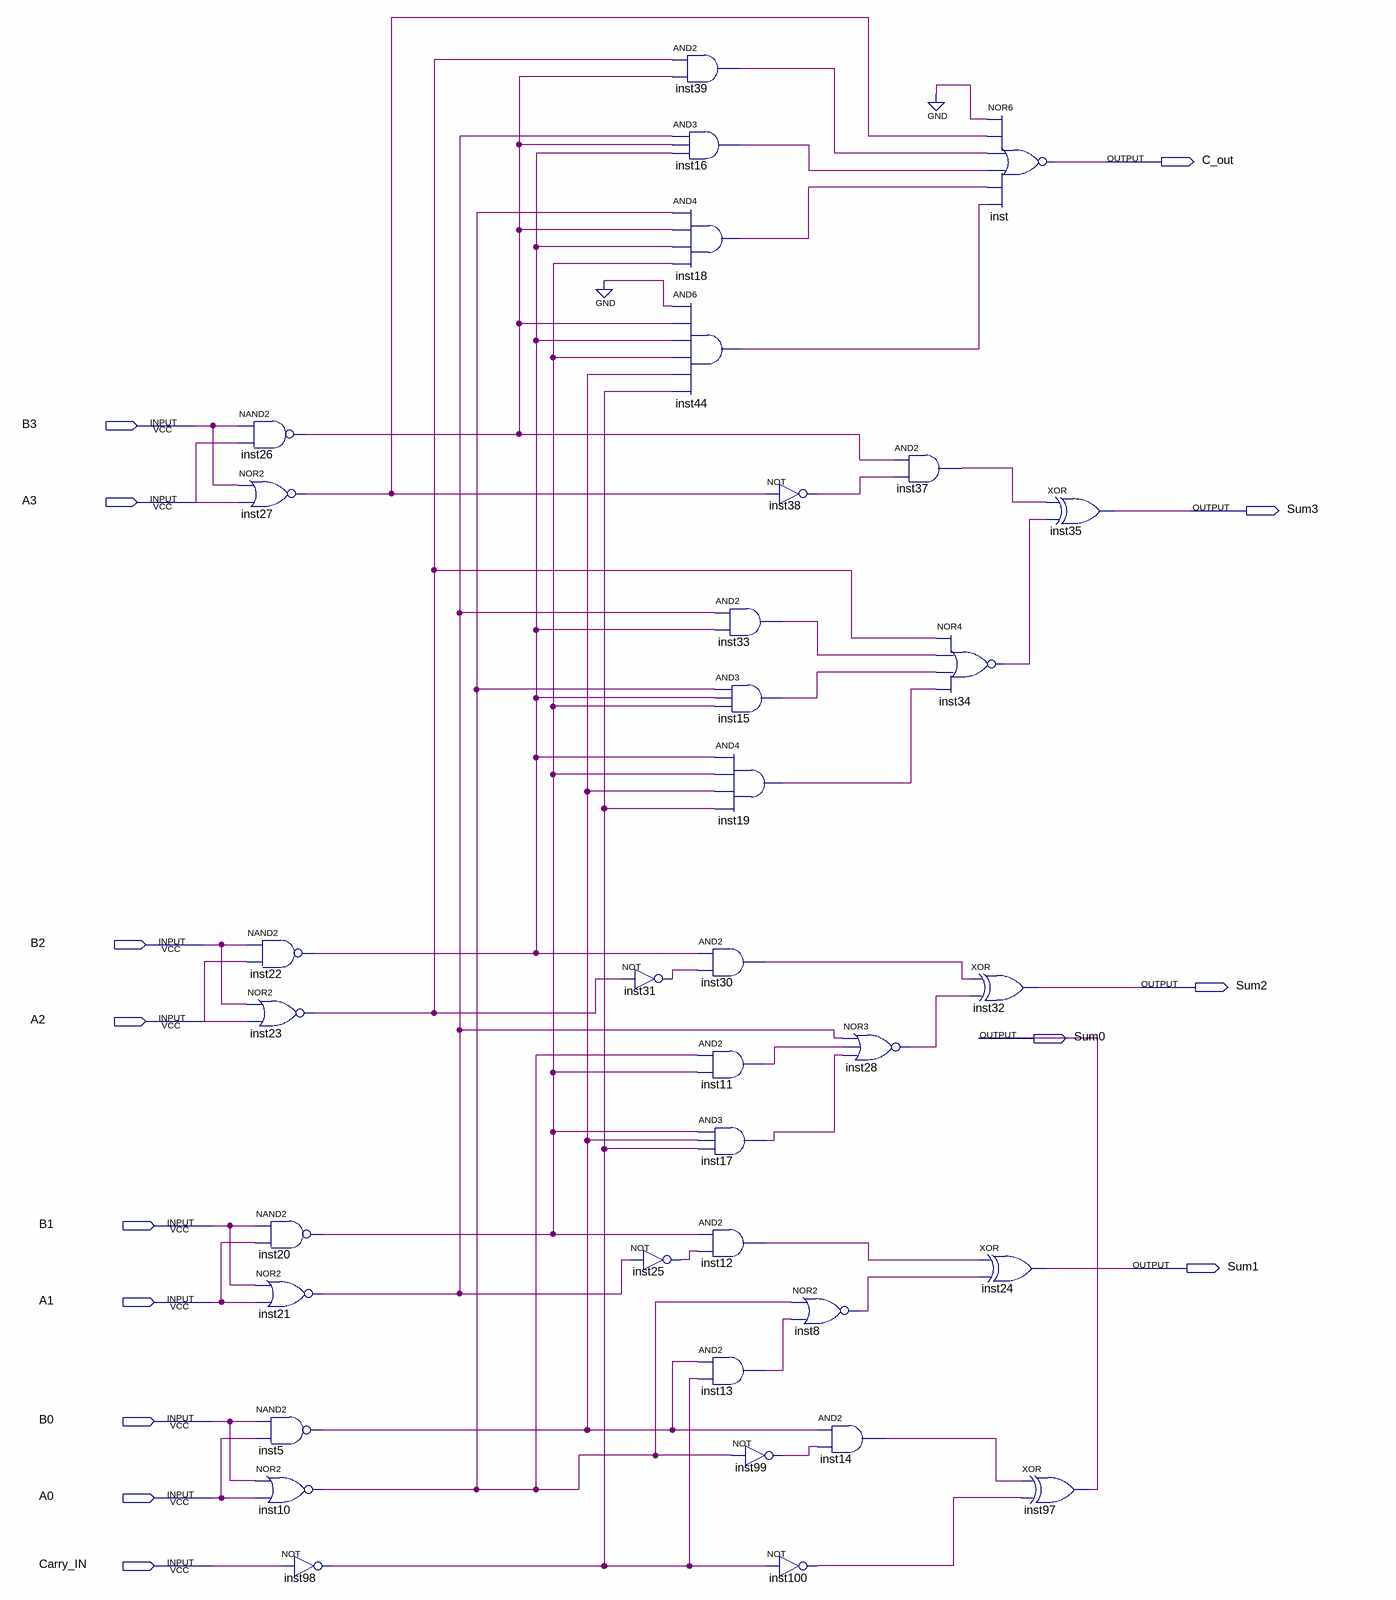
[diagram p0: schematic sheet]
// Quartus schematic Somador_Completo_74_283.bdf as structural Verilog: 36 symbols, 14 pins
module Somador_Completo_74_283 (
  input  B3,
  input  A3,
  input  B2,
  input  A2,
  input  B1,
  input  A1,
  input  B0,
  input  A0,
  input  Carry_IN,
  output C_out,
  output Sum3,
  output Sum2,
  output Sum0,
  output Sum1
);

  wire inst5_out, inst8_out, inst10_out, inst11_out, inst12_out, inst13_out, inst14_out, inst15_out,
       inst16_out, inst17_out, inst18_out, inst19_out, inst20_out, inst21_out, inst22_out, inst23_out,
       inst25_out, inst26_out, inst27_out, inst28_out, inst30_out, inst31_out, inst33_out, inst34_out,
       inst37_out, inst38_out, inst39_out, inst44_out, inst98_out, inst99_out, inst100_out;

  nand inst26 (inst26_out, B3, A3);
  nor inst27 (inst27_out, B3, A3);
  nand inst22 (inst22_out, B2, A2);
  nor inst23 (inst23_out, B2, A2);
  nand inst20 (inst20_out, B1, A1);
  nor inst21 (inst21_out, B1, A1);
  nand inst5 (inst5_out, B0, A0);
  nor inst10 (inst10_out, B0, A0);
  not inst98 (inst98_out, Carry_IN);
  not inst31 (inst31_out, inst23_out);
  not inst25 (inst25_out, inst21_out);
  and inst39 (inst39_out, inst23_out, inst26_out);
  and inst16 (inst16_out, inst21_out, inst26_out, inst22_out);
  and inst18 (inst18_out, inst10_out, inst26_out, inst22_out, inst20_out);
  and inst44 (inst44_out, 1'b0, inst26_out, inst22_out, inst20_out, inst5_out, inst98_out);
  and inst33 (inst33_out, inst21_out, inst22_out);
  and inst15 (inst15_out, inst10_out, inst22_out, inst20_out);
  and inst19 (inst19_out, inst22_out, inst20_out, inst5_out, inst98_out);
  and inst30 (inst30_out, inst22_out, inst31_out);
  and inst11 (inst11_out, inst10_out, inst20_out);
  and inst17 (inst17_out, inst20_out, inst5_out, inst98_out);
  and inst12 (inst12_out, inst20_out, inst25_out);
  and inst13 (inst13_out, inst5_out, inst98_out);
  not inst38 (inst38_out, inst27_out);
  not inst99 (inst99_out, inst10_out);
  not inst100 (inst100_out, inst98_out);
  nor inst28 (inst28_out, inst21_out, inst11_out, inst17_out);
  nor inst8 (inst8_out, inst10_out, inst13_out);
  and inst14 (inst14_out, inst5_out, inst99_out);
  and inst37 (inst37_out, inst26_out, inst38_out);
  nor inst (C_out, 1'b0, inst27_out, inst39_out, inst16_out, inst18_out, inst44_out);
  nor inst34 (inst34_out, inst23_out, inst33_out, inst15_out, inst19_out);
  xor inst32 (Sum2, inst30_out, inst28_out);
  xor inst24 (Sum1, inst12_out, inst8_out);
  xor inst35 (Sum3, inst37_out, inst34_out);
  xor inst97 (Sum0, inst14_out, inst100_out);
endmodule
